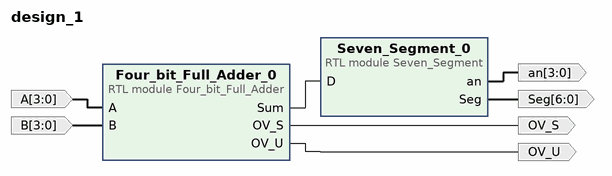
[diagram p0: block diagram of the top level]
# Vivado block design design_1, xc7a35tcpg236-1, Vivado 2021.1
create_bd_design design_1

create_bd_port -dir I -from 3 -to 0 A
create_bd_port -dir I -from 3 -to 0 B
create_bd_port -dir O -from 6 -to 0 Seg
create_bd_port -dir O -from 3 -to 0 an
create_bd_port -dir O OV_S
create_bd_port -dir O OV_U

create_bd_cell -type module -reference Seven_Segment Seven_Segment_0
create_bd_cell -type module -reference Four_bit_Full_Adder Four_bit_Full_Adder_0

# ---- connections ----

connect_bd_net [get_bd_ports A] [get_bd_pins Four_bit_Full_Adder_0/A]
connect_bd_net [get_bd_ports B] [get_bd_pins Four_bit_Full_Adder_0/B]
connect_bd_net [get_bd_pins Four_bit_Full_Adder_0/OV_S] [get_bd_ports OV_S]
connect_bd_net [get_bd_pins Four_bit_Full_Adder_0/OV_U] [get_bd_ports OV_U]
connect_bd_net [get_bd_pins Four_bit_Full_Adder_0/Sum] [get_bd_pins Seven_Segment_0/D]
connect_bd_net [get_bd_pins Seven_Segment_0/Seg] [get_bd_ports Seg]
connect_bd_net [get_bd_pins Seven_Segment_0/an] [get_bd_ports an]

validate_bd_design
save_bd_design
